# Altium project BETTERGREENLED.PrjPcb
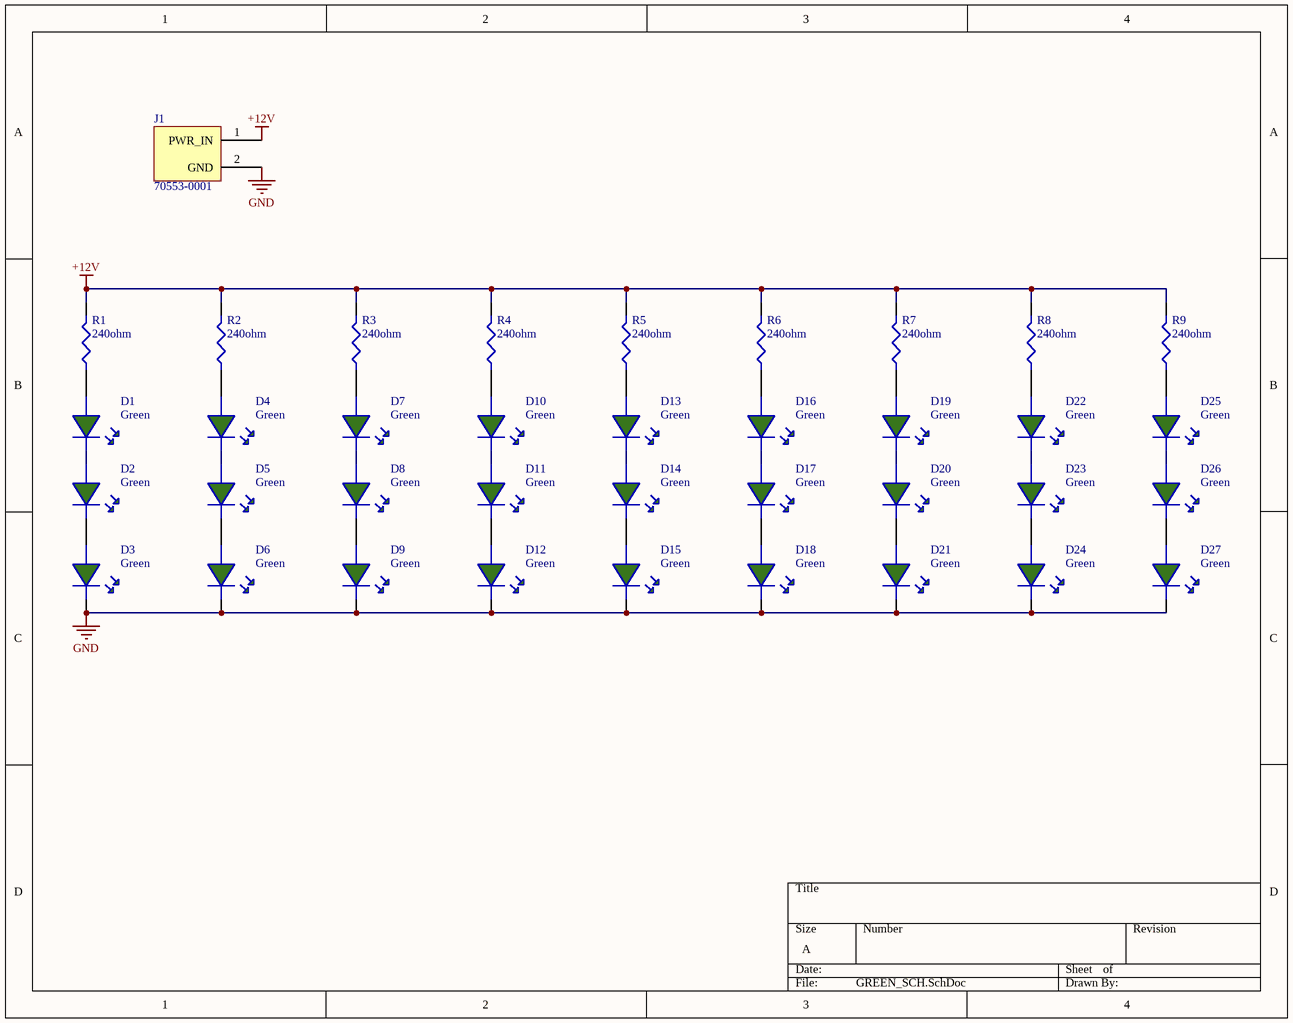
[diagram p0: GREEN_SCH.SchDoc]
1 sheet, 37 parts. Net scope: global (net labels, ports and power ports of the same name join across sheets).
Board file: GREENLED_PCB.PcbDoc

## Sheet GREEN_SCH.SchDoc
size A

### Parts
D1  Green  [GREEN_LED]
D2  Green  [GREEN_LED]
D3  Green  [GREEN_LED]
D4  Green  [GREEN_LED]
D5  Green  [GREEN_LED]
D6  Green  [GREEN_LED]
D7  Green  [GREEN_LED]
D8  Green  [GREEN_LED]
D9  Green  [GREEN_LED]
D10  Green  [GREEN_LED]
D11  Green  [GREEN_LED]
D12  Green  [GREEN_LED]
D13  Green  [GREEN_LED]
D14  Green  [GREEN_LED]
D15  Green  [GREEN_LED]
D16  Green  [GREEN_LED]
D17  Green  [GREEN_LED]
D18  Green  [GREEN_LED]
D19  Green  [GREEN_LED]
D20  Green  [GREEN_LED]
D21  Green  [GREEN_LED]
D22  Green  [GREEN_LED]
D23  Green  [GREEN_LED]
D24  Green  [GREEN_LED]
D25  Green  [GREEN_LED]
D26  Green  [GREEN_LED]
D27  Green  [GREEN_LED]
J1  70553-0001  [CONNECTOR]
R1  240ohm  [RESISTOR_0805]
R2  240ohm  [RESISTOR_0805]
R3  240ohm  [RESISTOR_0805]
R4  240ohm  [RESISTOR_0805]
R5  240ohm  [RESISTOR_0805]
R6  240ohm  [RESISTOR_0805]
R7  240ohm  [RESISTOR_0805]
R8  240ohm  [RESISTOR_0805]
R9  240ohm  [RESISTOR_0805]

### Nets
+12V: J1.1(PWR_IN) R1.2 R2.2 R3.2 R4.2 R5.2 R6.2 R7.2 R8.2 R9.2
GND: D3.2 D6.2 D9.2 D12.2 D15.2 D18.2 D21.2 D24.2 D27.2 J1.2(GND)
NetD1_1: D1.1 R1.1
NetD1_2: D1.2 D2.1
NetD2_2: D2.2 D3.1
NetD4_1: D4.1 R2.1
NetD4_2: D4.2 D5.1
NetD5_2: D5.2 D6.1
NetD7_1: D7.1 R3.1
NetD7_2: D7.2 D8.1
NetD8_2: D8.2 D9.1
NetD10_1: D10.1 R4.1
NetD10_2: D10.2 D11.1
NetD11_2: D11.2 D12.1
NetD13_1: D13.1 R5.1
NetD13_2: D13.2 D14.1
NetD14_2: D14.2 D15.1
NetD16_1: D16.1 R6.1
NetD16_2: D16.2 D17.1
NetD17_2: D17.2 D18.1
NetD19_1: D19.1 R7.1
NetD19_2: D19.2 D20.1
NetD20_2: D20.2 D21.1
NetD22_1: D22.1 R8.1
NetD22_2: D22.2 D23.1
NetD23_2: D23.2 D24.1
NetD25_1: D25.1 R9.1
NetD25_2: D25.2 D26.1
NetD26_2: D26.2 D27.1

### Library data of the parts
D1-D27 = IN-S63AT5G: LED GREEN CLEAR 0603 SMD; Manufacturer: Inolux; Supplier 1: Digi-Key; Manufacturer Part Number: IN-S63AT5G; RoHS: No; Stock 1: 2843; Pricing 1: 1 = 0.55000, 10 = 0.39300, 25 = 0.30120, 100 = 0.19660, 250 = 0.14416, 500 = 0.12230, 1000 = 0.10046 (USD); ComponentLink1URL: http://www.inolux-corp.com/datasheet/SMDLED/Mono%20Color%20Top%20View/IN-S63AT%20Series_V1.1.pdf?src-supplier=Digi-Key; ComponentLink1Description: http://www.inolux-corp.com/datasheet/SMDLED/Mono%20Color%20Top%20View/IN-S63AT%20Series_V1.1.pdf?src-supplier=Digi-Key; Supplier Part Number 1: 1830-1062-1-ND
J1 = 70553-0001: Headers & Wire Housings R/A HDR 2P low profile single; Manufacturer: Molex; Number of Positions: 2; Gender: Male; Contact Resistance: 30mR; Current Rating: 3A; Voltage Rating: 250V; Insulation Resistance: 1GR; Pitch: 2.54mm; Approvals: UL; Glow Wire Compliant: Non-compliant; Supplier 1: Digi-Key; Manufacturer Part Number: 70553-0001; Stock 1: 12201; Pricing 1: 1 = 0.71000, 72 = 0.53486, 144 = 0.51264, 504 = 0.44575, 1008 = 0.36775, 5040 = 0.32318, 10008 = 0.30089 (USD); RoHS: Yes; Mount: Through Hole; Color: Black; Housing Color: Black; Housing Material: Thermoplastic; Contact Material: Bronze; Contact Plating: Gold; Material: Brass; Min Operating Temperature: -40°C; Max Operating Temperature: 105°C; Number of Rows: 1; Packaging: Rail/Tube; Termination: Through Hole; Number of Contacts: 2; Orientation: Right Angle; Package Quantity: 2880; Number of Circuits: 2; Voltage Rating (DC): 250V; Radiation Hardening: No; Lead Free: Lead Free; REACH SVHC: Unknown; ELV: Compliant; Flammability Rating: UL94 V-0; ComponentLink1URL: https://datasheet.ciiva.com/5158/0705530001-pcb-headers-172944-5158768.pdf?src-supplier=Mouser; ComponentLink1Description: https://datasheet.ciiva.com/5158/0705530001-pcb-headers-172944-5158768.pdf?src-supplier=Mouser; ComponentLink2URL: https://datasheet.ciiva.com/11746/0900766b80d8d649-11746625.pdf?src-supplier=RSComponents; ComponentLink2Description: https://datasheet.ciiva.com/11746/0900766b80d8d649-11746625.pdf?src-supplier=RSComponents; ComponentLink3URL: https://datasheet.ciiva.com/16657/0705530001-pcb-headers-16657777.pdf?src-supplier=Avnet+Europe; ComponentLink3Description: https://datasheet.ciiva.com/16657/0705530001-pcb-headers-16657777.pdf?src-supplier=Avnet+Europe; ComponentLink4URL: https://datasheet.ciiva.com/7920/ps-70541-7920854.pdf?src-supplier=Element14; ComponentLink4Description: https://datasheet.ciiva.com/7920/ps-70541-7920854.pdf?src-supplier=Element14; ComponentLink5URL: https://datasheet.ciiva.com/30195/179180705530001-pcb-headers-30195548.pdf?src-supplier=Onlinecomponents.com; ComponentLink5Description: https://datasheet.ciiva.com/30195/179180705530001-pcb-headers-30195548.pdf?src-supplier=Onlinecomponents.com; ComponentLink6URL: https://datasheet.ciiva.com/1438/1887076-1438989.pdf?src-supplier=Element14; ComponentLink6Description: https://datasheet.ciiva.com/1438/1887076-1438989.pdf?src-supplier=Element14; ComponentLink7URL: https://datasheet.ciiva.com/10090/0705530001-pcb-headers-10090317.pdf?src-supplier=Avnet; ComponentLink7Description: https://datasheet.ciiva.com/10090/0705530001-pcb-headers-10090317.pdf?src-supplier=Avnet; Supplier Part Number 1: WM4900-ND
R1-R9 = ERA-6AEB241V: RES SMD 240 OHM 0.1% 1/8W 0805; Manufacturer: Panasonic; Resistance: 240R; Power Rating: 125mW; Voltage Rating: 100V; Temperature Coefficient: 25ppm/°C; Supplier 1: Digi-Key; Manufacturer Part Number: ERA-6AEB241V; Stock 1: 47229; Pricing 1: 1 = 0.36000, 10 = 0.30200, 100 = 0.11820, 1000 = 0.04948, 2500 = 0.04536 (USD); RoHS: Yes; Mount: Surface Mount; Case/Package: 0805; Number of Pins: 2; Case Code (Metric): 2012; Case Code (Imperial): 0805; Contact Plating: Tin; Min Operating Temperature: -55°C; Max Operating Temperature: 155°C; Tolerance: 0.1%; Packaging: Tape and Reel; Package Quantity: 1; Composition: Thin Film; Number of Terminations: 2; Military Standard: Not; Termination: Solder; Max Power Dissipation: 125mW; Voltage Rating (DC): 100V; Features: Automotive AEC-Q200; Length: 2mm; Height: 0.5mm; Width: 1.25mm; Depth: 1.25mm; Radiation Hardening: No; REACH SVHC: No SVHC; Lead Free: Lead Free; ComponentLink1URL: https://datasheet.ciiva.com/29184/452815-da-01-en-widerstand-0805-era-29184072.pdf?src-supplier=Conrad; ComponentLink1Description: https://datasheet.ciiva.com/29184/452815-da-01-en-widerstand-0805-era-29184072.pdf?src-supplier=Conrad; ComponentLink2URL: https://datasheet.ciiva.com/5915/485442-5915205.pdf?src-supplier=Farnell; ComponentLink2Description: https://datasheet.ciiva.com/5915/485442-5915205.pdf?src-supplier=Farnell; ComponentLink3URL: https://datasheet.ciiva.com/30154/54aoa0000ce26-30154486.pdf?src-supplier=Onlinecomponents.com; ComponentLink3Description: https://datasheet.ciiva.com/30154/54aoa0000ce26-30154486.pdf?src-supplier=Onlinecomponents.com; ComponentLink4URL: https://datasheet.ciiva.com/48425/era-eng-tds-48425782.pdf?src-supplier=Distrelec; ComponentLink4Description: https://datasheet.ciiva.com/48425/era-eng-tds-48425782.pdf?src-supplier=Distrelec; ComponentLink5URL: https://datasheet.ciiva.com/5915/485442-5915208.pdf?src-supplier=Farnell; ComponentLink5Description: https://datasheet.ciiva.com/5915/485442-5915208.pdf?src-supplier=Farnell; ComponentLink6URL: https://datasheet.ciiva.com/43455/485442-43455397.pdf?src-supplier=Farnell; ComponentLink6Description: https://datasheet.ciiva.com/43455/485442-43455397.pdf?src-supplier=Farnell; ComponentLink7URL: https://datasheet.ciiva.com/46389/485442-46389960.pdf?src-supplier=Element14; ComponentLink7Description: https://datasheet.ciiva.com/46389/485442-46389960.pdf?src-supplier=Element14; ComponentLink8URL: https://datasheet.ciiva.com/46389/485442-46389961.pdf?src-supplier=Element14; ComponentLink8Description: https://datasheet.ciiva.com/46389/485442-46389961.pdf?src-supplier=Element14; ComponentLink9URL: https://datasheet.ciiva.com/48536/era-eng-tds-48536634.pdf?src-supplier=Distrelec; ComponentLink9Description: https://datasheet.ciiva.com/48536/era-eng-tds-48536634.pdf?src-supplier=Distrelec; ComponentLink10URL: https://datasheet.ciiva.com/22739/485442-22739483.pdf?src-supplier=Element14; ComponentLink10Description: https://datasheet.ciiva.com/22739/485442-22739483.pdf?src-supplier=Element14; ComponentLink11URL: https://datasheet.ciiva.com/17206/aoa0000ce26-17206700.pdf?src-supplier=Avnet+Europe; ComponentLink11Description: https://datasheet.ciiva.com/17206/aoa0000ce26-17206700.pdf?src-supplier=Avnet+Europe; ComponentLink12URL: https://datasheet.ciiva.com/43457/485442-43457869.pdf?src-supplier=Farnell; ComponentLink12Description: https://datasheet.ciiva.com/43457/485442-43457869.pdf?src-supplier=Farnell; Supplier Part Number 1: P240DACT-ND